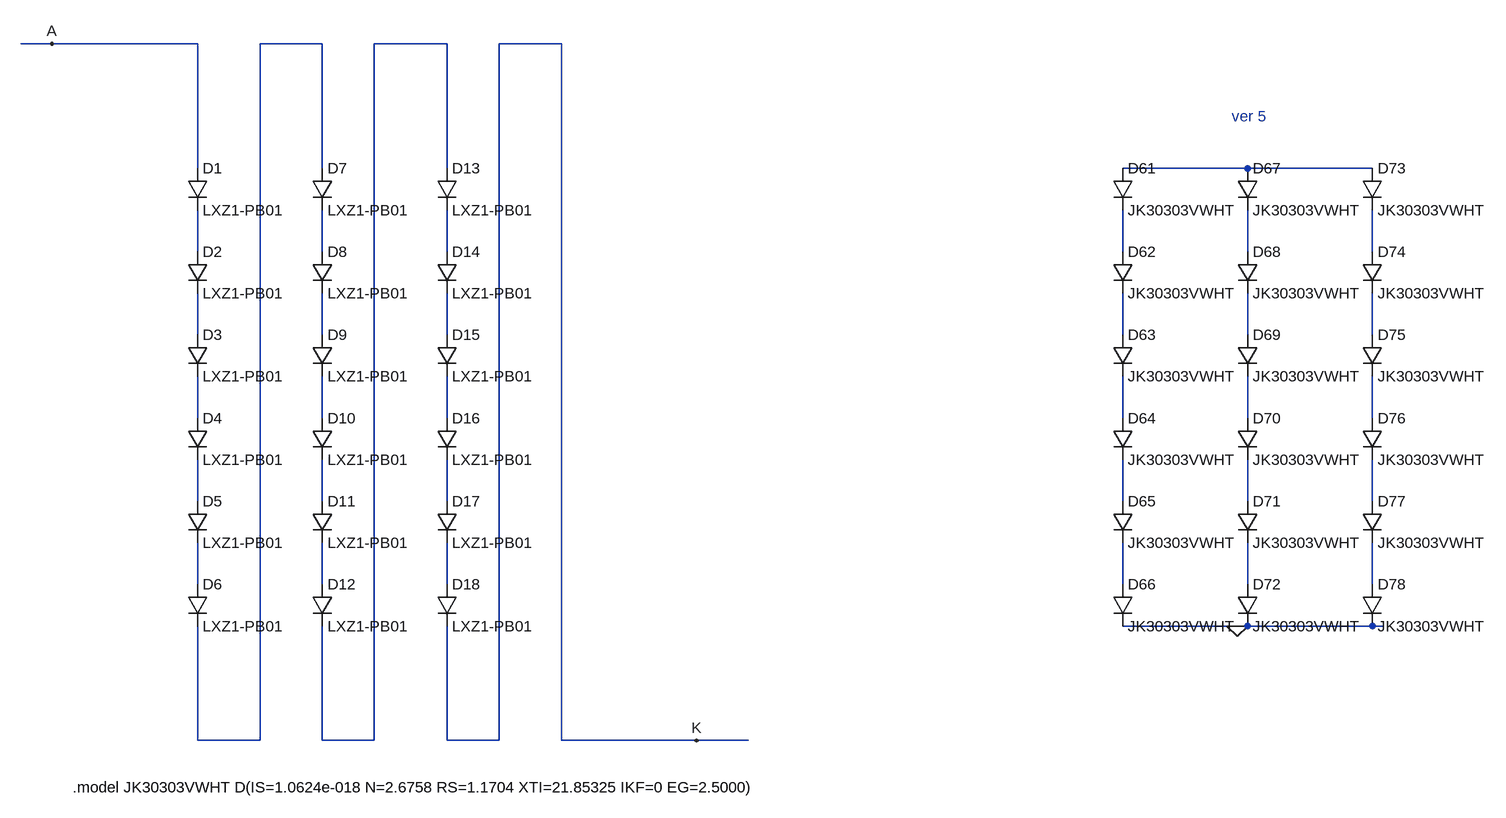
[diagram p0: schematic LED_strip.asc]
LED_strip.asc, the LTspice schematic file:
Version 4.1
SHEET 1 4488 1172
WIRE 16 -16 -32 -16
WIRE 240 -16 16 -16
WIRE 432 -16 336 -16
WIRE 624 -16 512 -16
WIRE 800 -16 704 -16
WIRE 240 176 240 -16
WIRE 432 176 432 -16
WIRE 624 176 624 -16
WIRE 1856 176 1664 176
WIRE 2048 176 1856 176
WIRE 240 304 240 240
WIRE 432 304 432 240
WIRE 624 304 624 240
WIRE 1664 304 1664 240
WIRE 1856 304 1856 240
WIRE 2048 304 2048 240
WIRE 240 432 240 368
WIRE 432 432 432 368
WIRE 624 432 624 368
WIRE 1664 432 1664 368
WIRE 1856 432 1856 368
WIRE 2048 432 2048 368
WIRE 240 560 240 496
WIRE 432 560 432 496
WIRE 624 560 624 496
WIRE 1664 560 1664 496
WIRE 1856 560 1856 496
WIRE 2048 560 2048 496
WIRE 240 688 240 624
WIRE 432 688 432 624
WIRE 624 688 624 624
WIRE 1664 688 1664 624
WIRE 1856 688 1856 624
WIRE 2048 688 2048 624
WIRE 240 816 240 752
WIRE 432 816 432 752
WIRE 624 816 624 752
WIRE 1664 816 1664 752
WIRE 1856 816 1856 752
WIRE 2048 816 2048 752
WIRE 1840 880 1664 880
WIRE 1856 880 1840 880
WIRE 2048 880 1856 880
WIRE 2064 880 2048 880
WIRE 240 1056 240 880
WIRE 336 1056 336 -16
WIRE 336 1056 240 1056
WIRE 432 1056 432 880
WIRE 512 1056 512 -16
WIRE 512 1056 432 1056
WIRE 624 1056 624 880
WIRE 704 1056 704 -16
WIRE 704 1056 624 1056
WIRE 800 1056 800 -16
WIRE 1008 1056 800 1056
WIRE 1088 1056 1008 1056
FLAG 16 -16 A
FLAG 1008 1056 K
FLAG 1840 880 0
SYMBOL diode 1648 176 R0
SYMATTR InstName D61
SYMATTR Value JK30303VWHT
SYMBOL diode 1648 304 R0
SYMATTR InstName D62
SYMATTR Value JK30303VWHT
SYMBOL diode 1648 432 R0
SYMATTR InstName D63
SYMATTR Value JK30303VWHT
SYMBOL diode 1648 560 R0
SYMATTR InstName D64
SYMATTR Value JK30303VWHT
SYMBOL diode 1648 688 R0
SYMATTR InstName D65
SYMATTR Value JK30303VWHT
SYMBOL diode 1648 816 R0
SYMATTR InstName D66
SYMATTR Value JK30303VWHT
SYMBOL diode 1840 176 R0
SYMATTR InstName D67
SYMATTR Value JK30303VWHT
SYMBOL diode 1840 304 R0
SYMATTR InstName D68
SYMATTR Value JK30303VWHT
SYMBOL diode 1840 432 R0
SYMATTR InstName D69
SYMATTR Value JK30303VWHT
SYMBOL diode 1840 560 R0
SYMATTR InstName D70
SYMATTR Value JK30303VWHT
SYMBOL diode 1840 688 R0
SYMATTR InstName D71
SYMATTR Value JK30303VWHT
SYMBOL diode 1840 816 R0
SYMATTR InstName D72
SYMATTR Value JK30303VWHT
SYMBOL diode 2032 176 R0
SYMATTR InstName D73
SYMATTR Value JK30303VWHT
SYMBOL diode 2032 304 R0
SYMATTR InstName D74
SYMATTR Value JK30303VWHT
SYMBOL diode 2032 432 R0
SYMATTR InstName D75
SYMATTR Value JK30303VWHT
SYMBOL diode 2032 560 R0
SYMATTR InstName D76
SYMATTR Value JK30303VWHT
SYMBOL diode 2032 688 R0
SYMATTR InstName D77
SYMATTR Value JK30303VWHT
SYMBOL diode 2032 816 R0
SYMATTR InstName D78
SYMATTR Value JK30303VWHT
SYMBOL diode 224 176 R0
SYMATTR InstName D1
SYMATTR Value LXZ1-PB01
SYMBOL diode 224 304 R0
SYMATTR InstName D2
SYMATTR Value LXZ1-PB01
SYMBOL diode 224 432 R0
SYMATTR InstName D3
SYMATTR Value LXZ1-PB01
SYMBOL diode 224 560 R0
SYMATTR InstName D4
SYMATTR Value LXZ1-PB01
SYMBOL diode 224 688 R0
SYMATTR InstName D5
SYMATTR Value LXZ1-PB01
SYMBOL diode 224 816 R0
SYMATTR InstName D6
SYMATTR Value LXZ1-PB01
SYMBOL diode 416 176 R0
SYMATTR InstName D7
SYMATTR Value LXZ1-PB01
SYMBOL diode 416 304 R0
SYMATTR InstName D8
SYMATTR Value LXZ1-PB01
SYMBOL diode 416 432 R0
SYMATTR InstName D9
SYMATTR Value LXZ1-PB01
SYMBOL diode 416 560 R0
SYMATTR InstName D10
SYMATTR Value LXZ1-PB01
SYMBOL diode 416 688 R0
SYMATTR InstName D11
SYMATTR Value LXZ1-PB01
SYMBOL diode 416 816 R0
SYMATTR InstName D12
SYMATTR Value LXZ1-PB01
SYMBOL diode 608 176 R0
SYMATTR InstName D13
SYMATTR Value LXZ1-PB01
SYMBOL diode 608 304 R0
SYMATTR InstName D14
SYMATTR Value LXZ1-PB01
SYMBOL diode 608 432 R0
SYMATTR InstName D15
SYMATTR Value LXZ1-PB01
SYMBOL diode 608 560 R0
SYMATTR InstName D16
SYMATTR Value LXZ1-PB01
SYMBOL diode 608 688 R0
SYMATTR InstName D17
SYMATTR Value LXZ1-PB01
SYMBOL diode 608 816 R0
SYMATTR InstName D18
SYMATTR Value LXZ1-PB01
TEXT 48 1128 Left 2 !.model JK30303VWHT D(IS=1.0624e-018 N=2.6758 RS=1.1704 XTI=21.85325 IKF=0 EG=2.5000)
TEXT 1832 96 Left 2 ;ver 5

The netlist it stands for:
* LED_strip.asc
D61 N003 N007 JK30303VWHT
D62 N007 N013 JK30303VWHT
D63 N013 N019 JK30303VWHT
D64 N019 N025 JK30303VWHT
D65 N025 N031 JK30303VWHT
D66 N031 0 JK30303VWHT
D67 N003 N008 JK30303VWHT
D68 N008 N014 JK30303VWHT
D69 N014 N020 JK30303VWHT
D70 N020 N026 JK30303VWHT
D71 N026 N032 JK30303VWHT
D72 N032 0 JK30303VWHT
D73 N003 N009 JK30303VWHT
D74 N009 N015 JK30303VWHT
D75 N015 N021 JK30303VWHT
D76 N021 N027 JK30303VWHT
D77 N027 N033 JK30303VWHT
D78 N033 0 JK30303VWHT
D1 A N004 LXZ1-PB01
D2 N004 N010 LXZ1-PB01
D3 N010 N016 LXZ1-PB01
D4 N016 N022 LXZ1-PB01
D5 N022 N028 LXZ1-PB01
D6 N028 N001 LXZ1-PB01
D7 N001 N005 LXZ1-PB01
D8 N005 N011 LXZ1-PB01
D9 N011 N017 LXZ1-PB01
D10 N017 N023 LXZ1-PB01
D11 N023 N029 LXZ1-PB01
D12 N029 N002 LXZ1-PB01
D13 N002 N006 LXZ1-PB01
D14 N006 N012 LXZ1-PB01
D15 N012 N018 LXZ1-PB01
D16 N018 N024 LXZ1-PB01
D17 N024 N030 LXZ1-PB01
D18 N030 K LXZ1-PB01
.model D D
.lib standard.dio
.model JK30303VWHT D(IS=1.0624e-018 N=2.6758 RS=1.1704 XTI=21.85325 IKF=0 EG=2.5000)
* ver 5
.backanno
.end